# Altium schematic sheet CAN.SchDoc
size A
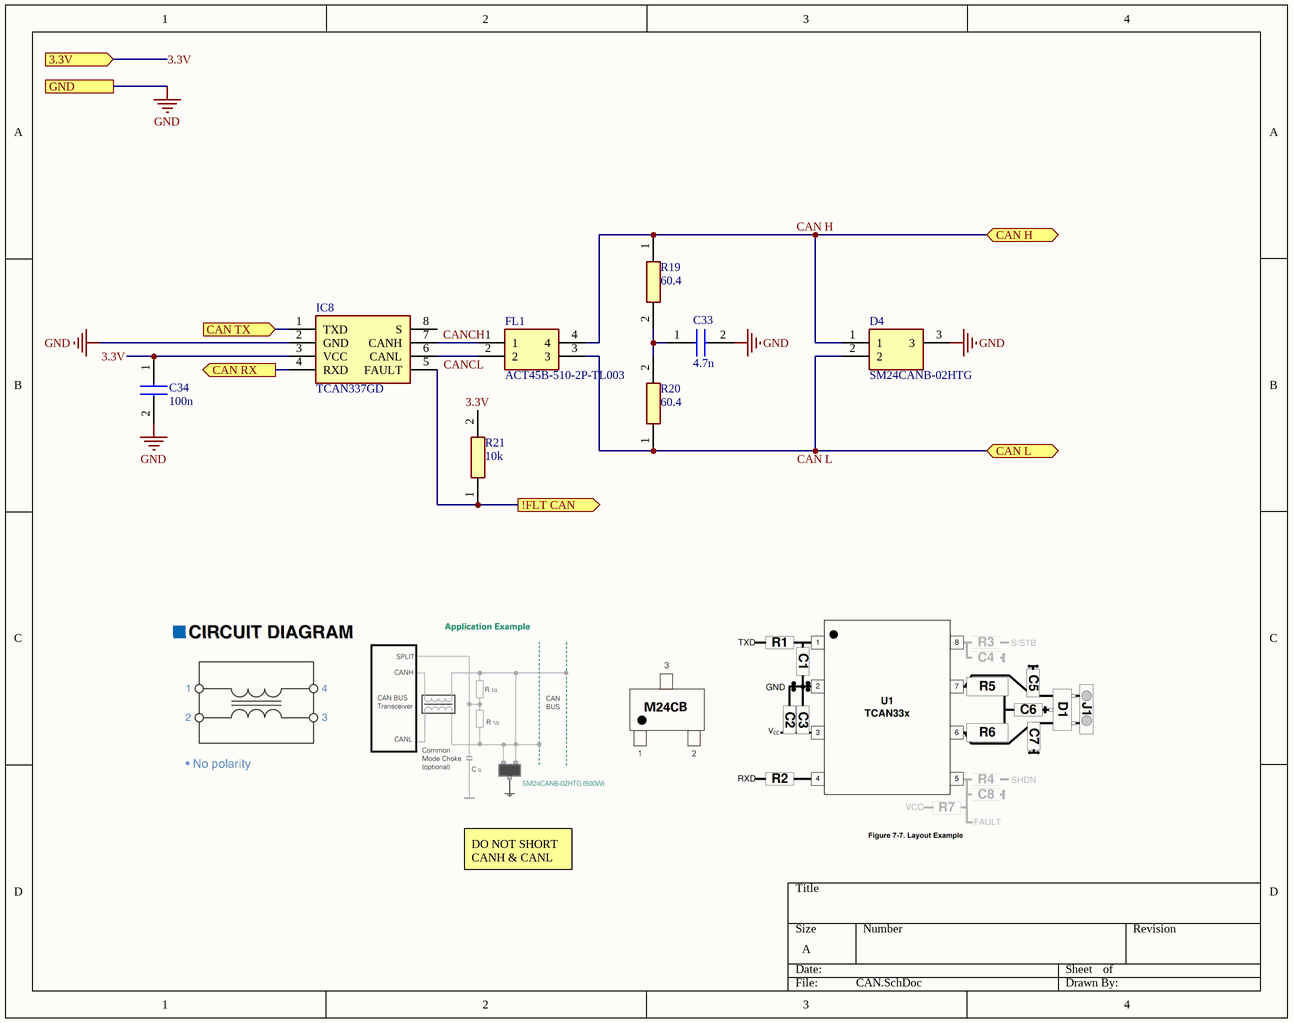
[diagram p0: CAN.SchDoc]

## Parts
C33  4.7n  [CAPC3216X75N]
C34  100n  [CAPC3216X94N]
D4  SM24CANB-02HTG  [SM24CANB02HTG]
FL1  ACT45B-510-2P-TL003  [ACT45B1012PTL003]
IC8  TCAN337GD  [SOIC127P600X175-8N]
R19  60.4  [RESC3216X65N]
R20  60.4  [RESC3216X65N]
R21  10k  [RESC3216X65N]

## Ports
3.3V (in), !FLT CAN (out), CAN H (bidir), CAN L (bidir), CAN RX (out), CAN TX (in), GND

## Nets
GND: C33.2 C34.2 D4.3 IC8.2(GND) ; port GND
3.3V: C34.1 IC8.3(VCC) R21.2 ; port 3.3V
!FLT CAN: IC8.5(FAULT) R21.1 ; port !FLT CAN
CAN H: D4.1 FL1.4 R19.1 ; port CAN H
CAN L: D4.2 FL1.3 R20.1 ; port CAN L
CAN RX: IC8.4(RXD) ; port CAN RX
CAN TX: IC8.1(TXD) ; port CAN TX
CANCH: FL1.1 IC8.7(CANH)
CANCL: FL1.2 IC8.6(CANL)
NetC33_1: C33.1 R19.2 R20.2

Not connected (* = marked no-connect by the designer): IC8 8(S)

## Notes on the sheet
- DO NOT SHORT CANH & CANL

## Library data of the parts
C33 = KAM31GR71H475KL: Capacitor; Manufacturer_Name: Kyocera AVX; Datasheet Link: https://www.mouser.jp/datasheet/2/40/AutoMLCCKAM-3216307.pdf; Height: 0.75mm; Manufacturer_Part_Number: KAM31GR71H475KL; Mouser Part Number: 581-KAM31GR71H475KL; Mouser Price/Stock: https://www.mouser.co.uk/ProductDetail/KYOCERA-AVX/KAM31GR71H475KL?qs=Jm2GQyTW%2FbjSbY1tCxiE1g%3D%3D
C34 = 12065C104J4Z2A: Capacitor; Manufacturer_Name: Kyocera AVX; Datasheet Link: https://spicat.kyocera-avx.com/product/mlcc/chartview/12065C104J4Z2A/DataSheet/X7R; Height: 0.94mm; Manufacturer_Part_Number: 12065C104J4Z2A; Mouser Part Number: 581-12065C104J4Z2A; Mouser Price/Stock: https://www.mouser.com/Search/Refine.aspx?Keyword=581-12065C104J4Z2A
D4 = SM24CANB-02HTG: TVS Diode (Bi-directional); Manufacturer_Name: LITTELFUSE; Datasheet Link: https://www.littelfuse.com/products/overvoltage-protection/tvs-diode-arrays/general-purpose/sm24canb/sm24canb-02htg; Height: 1.12mm; Manufacturer_Part_Number: SM24CANB-02HTG; Mouser Part Number: 576-SM24CANB-02HTG; Mouser Price/Stock: https://www.mouser.co.uk/ProductDetail/Littelfuse/SM24CANB-02HTG?qs=bWsWnctWn1wbKmCYlcUmHw%3D%3D; Arrow Part Number: SM24CANB-02HTG; Arrow Price/Stock: https://www.arrow.com/en/products/sm24canb-02htg/littelfuse?utm_currency=USD&region=nac
FL1 = ACT45B-510-2P-TL003: Filter; Manufacturer_Name: TDK; Datasheet Link: https://product.tdk.com/system/files/dam/doc/product/emc/emc/cmf_cmc/catalog/cmf_automotive_signal_act45b_en.pdf; Height: 3mm; Manufacturer_Part_Number: ACT45B-510-2P-TL003; Mouser Part Number: 810-ACT45B5102PTL003; Mouser Price/Stock: https://www.mouser.co.uk/ProductDetail/TDK/ACT45B-510-2P-TL003?qs=U1cgCdF9Le9LCroNYLqljw%3D%3D; Arrow Part Number: ACT45B-510-2P-TL003; Arrow Price/Stock: https://www.arrow.com/en/products/act45b-510-2p-tl003/tdk?utm_currency=USD&region=nac
IC8 = TCAN337GD: Integrated Circuit; Manufacturer_Name: Texas Instruments; Datasheet Link: https://www.arrow.com/en/products/tcan337gd/texas-instruments; Height: 1.75mm; Manufacturer_Part_Number: TCAN337GD; Mouser Part Number: 595-TCAN337GD; Mouser Price/Stock: https://www.mouser.co.uk/ProductDetail/Texas-Instruments/TCAN337GD?qs=gMfM3zrbS4qmjQESf%252BTgJw%3D%3D; Arrow Part Number: TCAN337GD; Arrow Price/Stock: https://www.arrow.com/en/products/tcan337gd/texas-instruments?region=europe
R19 R20 = ESR18EZPF60R4: Resistor; Manufacturer_Name: ROHM Semiconductor; Datasheet Link: https://datasheet.datasheetarchive.com/originals/dk/DKDS-18/356400.pdf; Height: 0.65mm; Manufacturer_Part_Number: ESR18EZPF60R4
R21 = SFR18EZPJ103: Resistor; Manufacturer_Name: ROHM Semiconductor; Datasheet Link: https://fscdn.rohm.com/en/products/databook/datasheet/passive/resistor/chip_resistor/sfr-e.pdf; Height: 0.65mm; Manufacturer_Part_Number: SFR18EZPJ103